# Altium project kashif.PrjPcb
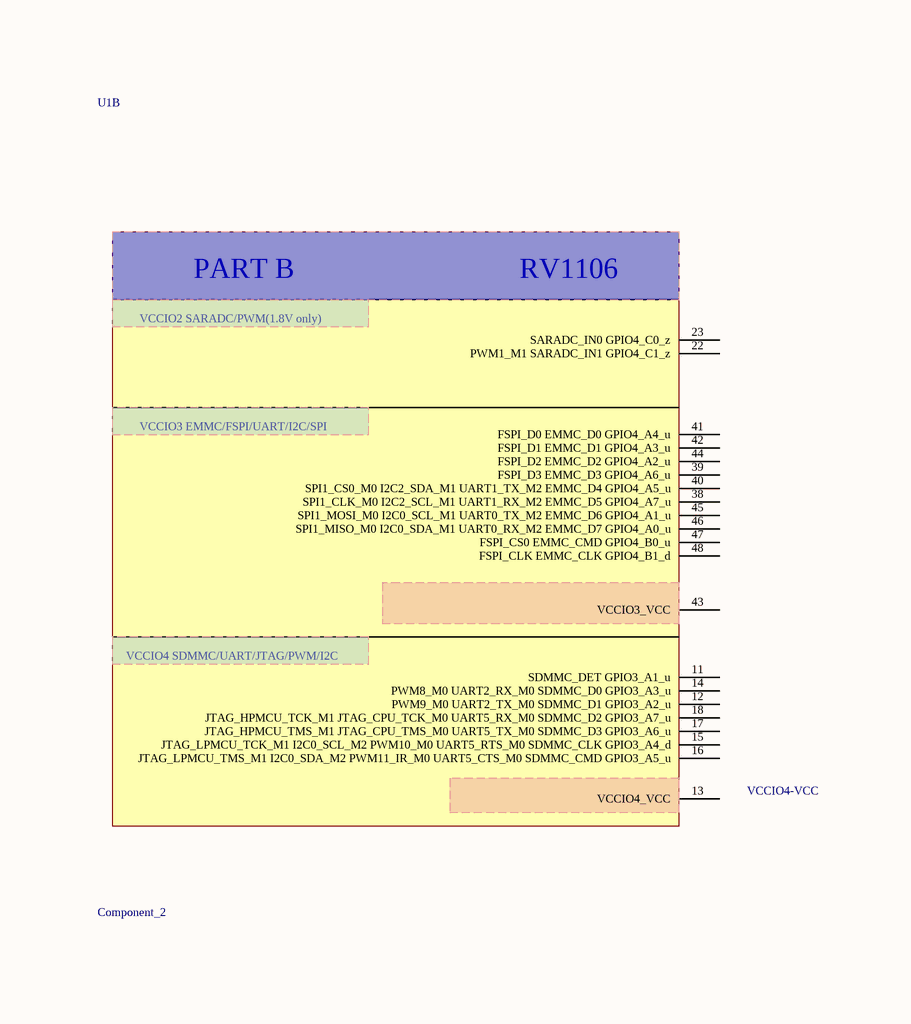
[diagram p0: main mcu.SchDoc, top left]
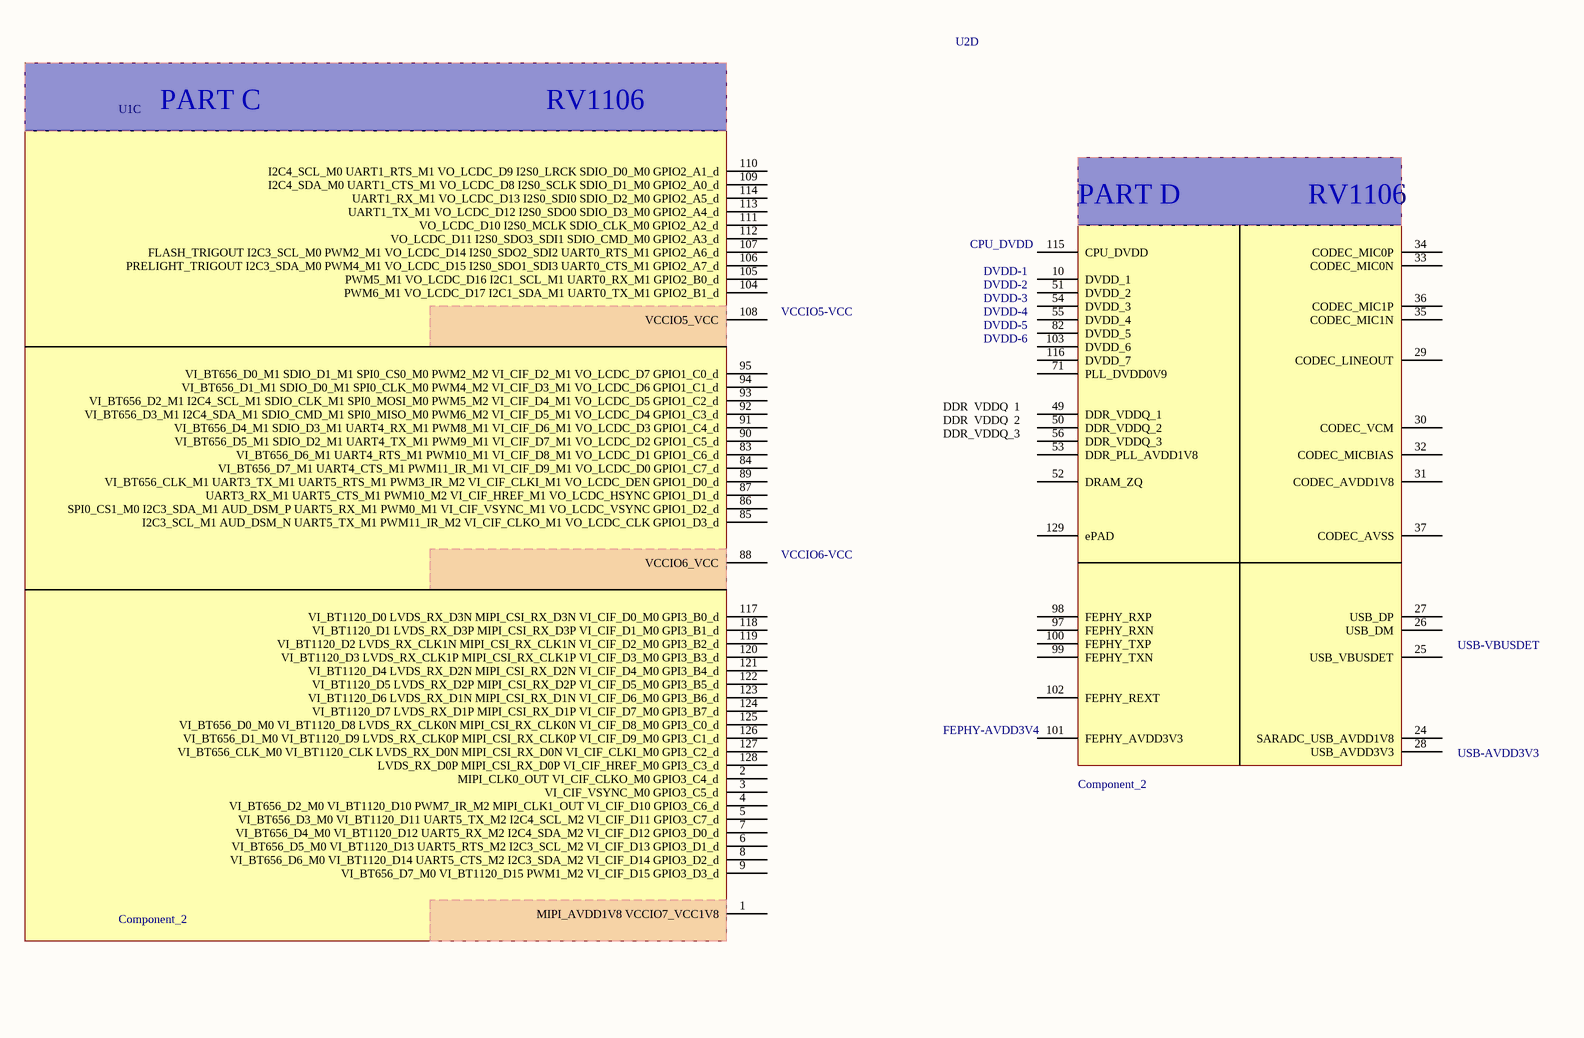
[diagram p1: main mcu.SchDoc, top right]
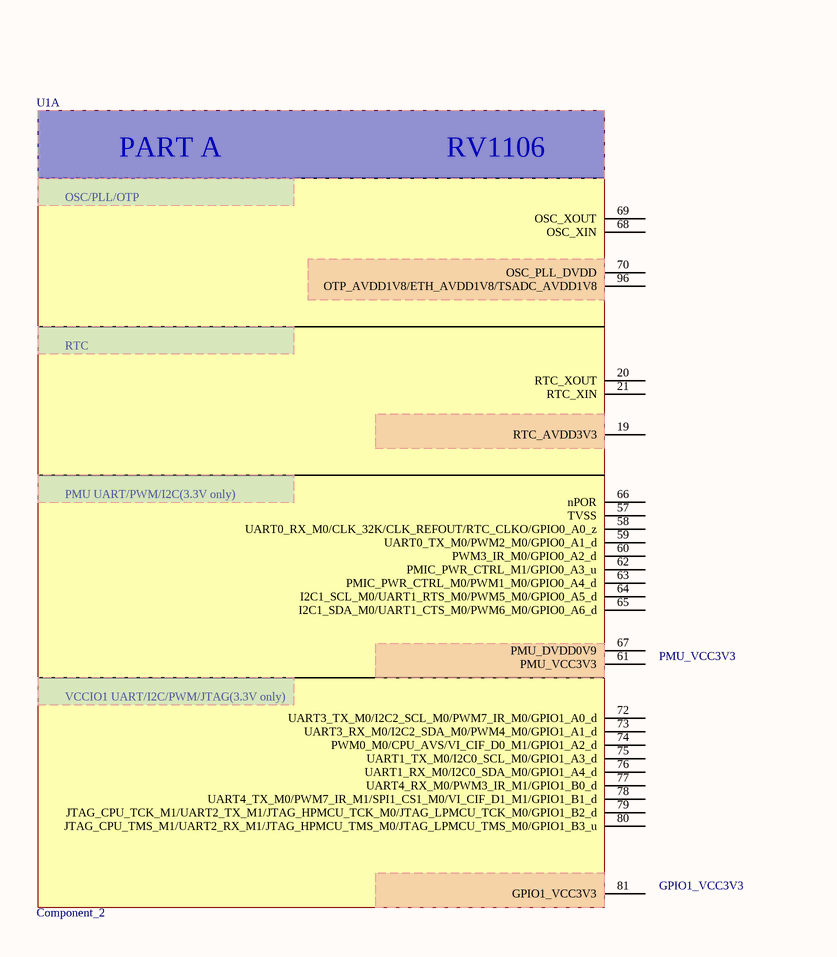
[diagram p2: main mcu.SchDoc, bottom left]
7 sheets, 131 parts. Net scope: global (net labels, ports and power ports of the same name join across sheets).
Board file: PCB1.PcbDoc
Sheets:
  main mcu.SchDoc
  CSI.SchDoc
  THERMAL.SchDoc
  ETHER.SchDoc
  power.SchDoc
  RXTRA.SchDoc
  32P MCU.SchDoc

## Sheet main mcu.SchDoc
size A1; SheetNumber: 1; SheetTotal: 5

### Parts
U1  Component_2  [QFN35P1230X1230X90_HS-129N]  (parts A,B,C of 4)
U2  Component_2  [QFN35P1230X1230X90_HS-129N]  (part D of 4)

### Nets

Not connected (* = marked no-connect by the designer): U1 1(MIPI_AVDD1V8_VCCIO7_VCC1V8) 2(MIPI_CLK0_OUT_VI_CIF_CLKO_M0_GPIO3_C4_d) 3(VI_CIF_VSYNC_M0_GPIO3_C5_d) 4(VI_BT656_D2_M0_VI_BT1120_D10_PWM7_IR_M2_MIPI_CLK1_OUT_VI_CIF_D10_GPIO3_C6_d) 5(VI_BT656_D3_M0_VI_BT1120_D11_UART5_TX_M2_I2C4_SCL_M2_VI_CIF_D11_GPIO3_C7_d) 6(VI_BT656_D5_M0_VI_BT1120_D13_UART5_RTS_M2_I2C3_SCL_M2_VI_CIF_D13_GPIO3_D1_d) 7(VI_BT656_D4_M0_VI_BT1120_D12_UART5_RX_M2_I2C4_SDA_M2_VI_CIF_D12_GPIO3_D0_d) 8(VI_BT656_D6_M0_VI_BT1120_D14_UART5_CTS_M2_I2C3_SDA_M2_VI_CIF_D14_GPIO3_D2_d) 9(VI_BT656_D7_M0_VI_BT1120_D15_PWM1_M2_VI_CIF_D15_GPIO3_D3_d) 11(SDMMC_DET_GPIO3_A1_u) 12(PWM9_M0_UART2_TX_M0_SDMMC_D1_GPIO3_A2_u) 13(VCCIO4_VCC) 14(PWM8_M0_UART2_RX_M0_SDMMC_D0_GPIO3_A3_u) 15(JTAG_LPMCU_TCK_M1_I2C0_SCL_M2_PWM10_M0_UART5_RTS_M0_SDMMC_CLK_GPIO3_A4_d) 16(JTAG_LPMCU_TMS_M1_I2C0_SDA_M2_PWM11_IR_M0_UART5_CTS_M0_SDMMC_CMD_GPIO3_A5_u) 17(JTAG_HPMCU_TMS_M1_JTAG_CPU_TMS_M0_UART5_TX_M0_SDMMC_D3_GPIO3_A6_u) 18(JTAG_HPMCU_TCK_M1_JTAG_CPU_TCK_M0_UART5_RX_M0_SDMMC_D2_GPIO3_A7_u) 19(RTC_AVDD3V3) 20(RTC_XOUT) 21(RTC_XIN) 22(PWM1_M1_SARADC_IN1_GPIO4_C1_z) 23(SARADC_IN0_GPIO4_C0_z) 38(SPI1_CLK_M0_I2C2_SCL_M1_UART1_RX_M2_EMMC_D5_GPIO4_A7_u) 39(FSPI_D3_EMMC_D3_GPIO4_A6_u) 40(SPI1_CS0_M0_I2C2_SDA_M1_UART1_TX_M2_EMMC_D4_GPIO4_A5_u) 41(FSPI_D0_EMMC_D0_GPIO4_A4_u) 42(FSPI_D1_EMMC_D1_GPIO4_A3_u) 43(VCCIO3_VCC) 44(FSPI_D2_EMMC_D2_GPIO4_A2_u) 45(SPI1_MOSI_M0_I2C0_SCL_M1_UART0_TX_M2_EMMC_D6_GPIO4_A1_u) 46(SPI1_MISO_M0_I2C0_SDA_M1_UART0_RX_M2_EMMC_D7_GPIO4_A0_u) 47(FSPI_CS0_EMMC_CMD_GPIO4_B0_u) 48(FSPI_CLK_EMMC_CLK_GPIO4_B1_d) 57(TVSS) 58(UART0_RX_M0/CLK_32K/CLK_REFOUT/RTC_CLKO/GPIO0_A0_z) 59(UART0_TX_M0/PWM2_M0/GPIO0_A1_d) 60(PWM3_IR_M0/GPIO0_A2_d) 61(PMU_VCC3V3) 62(PMIC_PWR_CTRL_M1/GPIO0_A3_u) 63(PMIC_PWR_CTRL_M0/PWM1_M0/GPIO0_A4_d) 64(I2C1_SCL_M0/UART1_RTS_M0/PWM5_M0/GPIO0_A5_d) 65(I2C1_SDA_M0/UART1_CTS_M0/PWM6_M0/GPIO0_A6_d) 66(nPOR) 67(PMU_DVDD0V9) 68(OSC_XIN) 69(OSC_XOUT) 70(OSC_PLL_DVDD) 72(UART3_TX_M0/I2C2_SCL_M0/PWM7_IR_M0/GPIO1_A0_d) 73(UART3_RX_M0/I2C2_SDA_M0/PWM4_M0/GPIO1_A1_d) 74(PWM0_M0/CPU_AVS/VI_CIF_D0_M1/GPIO1_A2_d) 75(UART1_TX_M0/I2C0_SCL_M0/GPIO1_A3_d) 76(UART1_RX_M0/I2C0_SDA_M0/GPIO1_A4_d) 77(UART4_RX_M0/PWM3_IR_M1/GPIO1_B0_d) 78(UART4_TX_M0/PWM7_IR_M1/SPI1_CS1_M0/VI_CIF_D1_M1/GPIO1_B1_d) 79(JTAG_CPU_TCK_M1/UART2_TX_M1/JTAG_HPMCU_TCK_M0/JTAG_LPMCU_TCK_M0/GPIO1_B2_d) 80(JTAG_CPU_TMS_M1/UART2_RX_M1/JTAG_HPMCU_TMS_M0/JTAG_LPMCU_TMS_M0/GPIO1_B3_u) 81(GPIO1_VCC3V3) 83(VI_BT656_D6_M1_UART4_RTS_M1_PWM10_M1_VI_CIF_D8_M1_VO_LCDC_D1_GPIO1_C6_d) 84(VI_BT656_D7_M1_UART4_CTS_M1_PWM11_IR_M1_VI_CIF_D9_M1_VO_LCDC_D0_GPIO1_C7_d) 85(I2C3_SCL_M1_AUD_DSM_N_UART5_TX_M1_PWM11_IR_M2_VI_CIF_CLKO_M1_VO_LCDC_CLK_GPIO1_D3_d) 86(SPI0_CS1_M0_I2C3_SDA_M1_AUD_DSM_P_UART5_RX_M1_PWM0_M1_VI_CIF_VSYNC_M1_VO_LCDC_VSYNC_GPIO1_D2_d) 87(UART3_RX_M1_UART5_CTS_M1_PWM10_M2_VI_CIF_HREF_M1_VO_LCDC_HSYNC_GPIO1_D1_d) 88(VCCIO6_VCC) 89(VI_BT656_CLK_M1_UART3_TX_M1_UART5_RTS_M1_PWM3_IR_M2_VI_CIF_CLKI_M1_VO_LCDC_DEN_GPIO1_D0_d) 90(VI_BT656_D5_M1_SDIO_D2_M1_UART4_TX_M1_PWM9_M1_VI_CIF_D7_M1_VO_LCDC_D2_GPIO1_C5_d) 91(VI_BT656_D4_M1_SDIO_D3_M1_UART4_RX_M1_PWM8_M1_VI_CIF_D6_M1_VO_LCDC_D3_GPIO1_C4_d) 92(VI_BT656_D3_M1_I2C4_SDA_M1_SDIO_CMD_M1_SPI0_MISO_M0_PWM6_M2_VI_CIF_D5_M1_VO_LCDC_D4_GPIO1_C3_d) 93(VI_BT656_D2_M1_I2C4_SCL_M1_SDIO_CLK_M1_SPI0_MOSI_M0_PWM5_M2_VI_CIF_D4_M1_VO_LCDC_D5_GPIO1_C2_d) 94(VI_BT656_D1_M1_SDIO_D0_M1_SPI0_CLK_M0_PWM4_M2_VI_CIF_D3_M1_VO_LCDC_D6_GPIO1_C1_d) 95(VI_BT656_D0_M1_SDIO_D1_M1_SPI0_CS0_M0_PWM2_M2_VI_CIF_D2_M1_VO_LCDC_D7_GPIO1_C0_d) 96(OTP_AVDD1V8/ETH_AVDD1V8/TSADC_AVDD1V8) 104(PWM6_M1_VO_LCDC_D17_I2C1_SDA_M1_UART0_TX_M1_GPIO2_B1_d) 105(PWM5_M1_VO_LCDC_D16_I2C1_SCL_M1_UART0_RX_M1_GPIO2_B0_d) 106(PRELIGHT_TRIGOUT_I2C3_SDA_M0_PWM4_M1_VO_LCDC_D15_I2S0_SDO1_SDI3_UART0_CTS_M1_GPIO2_A7_d) 107(FLASH_TRIGOUT_I2C3_SCL_M0_PWM2_M1_VO_LCDC_D14_I2S0_SDO2_SDI2_UART0_RTS_M1_GPIO2_A6_d) 108(VCCIO5_VCC) 109(I2C4_SDA_M0_UART1_CTS_M1_VO_LCDC_D8_I2S0_SCLK_SDIO_D1_M0_GPIO2_A0_d) 110(I2C4_SCL_M0_UART1_RTS_M1_VO_LCDC_D9_I2S0_LRCK_SDIO_D0_M0_GPIO2_A1_d) 111(VO_LCDC_D10_I2S0_MCLK_SDIO_CLK_M0_GPIO2_A2_d) 112(VO_LCDC_D11_I2S0_SDO3_SDI1_SDIO_CMD_M0_GPIO2_A3_d) 113(UART1_TX_M1_VO_LCDC_D12_I2S0_SDO0_SDIO_D3_M0_GPIO2_A4_d) 114(UART1_RX_M1_VO_LCDC_D13_I2S0_SDI0_SDIO_D2_M0_GPIO2_A5_d) 117(VI_BT1120_D0_LVDS_RX_D3N_MIPI_CSI_RX_D3N_VI_CIF_D0_M0_GPI3_B0_d) 118(VI_BT1120_D1_LVDS_RX_D3P_MIPI_CSI_RX_D3P_VI_CIF_D1_M0_GPI3_B1_d) 119(VI_BT1120_D2_LVDS_RX_CLK1N_MIPI_CSI_RX_CLK1N_VI_CIF_D2_M0_GPI3_B2_d) 120(VI_BT1120_D3_LVDS_RX_CLK1P_MIPI_CSI_RX_CLK1P_VI_CIF_D3_M0_GPI3_B3_d) 121(VI_BT1120_D4_LVDS_RX_D2N_MIPI_CSI_RX_D2N_VI_CIF_D4_M0_GPI3_B4_d) 122(VI_BT1120_D5_LVDS_RX_D2P_MIPI_CSI_RX_D2P_VI_CIF_D5_M0_GPI3_B5_d) 123(VI_BT1120_D6_LVDS_RX_D1N_MIPI_CSI_RX_D1N_VI_CIF_D6_M0_GPI3_B6_d) 124(VI_BT1120_D7_LVDS_RX_D1P_MIPI_CSI_RX_D1P_VI_CIF_D7_M0_GPI3_B7_d) 125(VI_BT656_D0_M0_VI_BT1120_D8_LVDS_RX_CLK0N_MIPI_CSI_RX_CLK0N_VI_CIF_D8_M0_GPI3_C0_d) 126(VI_BT656_D1_M0_VI_BT1120_D9_LVDS_RX_CLK0P_MIPI_CSI_RX_CLK0P_VI_CIF_D9_M0_GPI3_C1_d) 127(VI_BT656_CLK_M0_VI_BT1120_CLK_LVDS_RX_D0N_MIPI_CSI_RX_D0N_VI_CIF_CLKI_M0_GPI3_C2_d) 128(LVDS_RX_D0P_MIPI_CSI_RX_D0P_VI_CIF_HREF_M0_GPI3_C3_d); U2 10(DVDD_1) 24(SARADC_USB_AVDD1V8) 25(USB_VBUSDET) 26(USB_DM) 27(USB_DP) 28(USB_AVDD3V3) 29(CODEC_LINEOUT) 30(CODEC_VCM) 31(CODEC_AVDD1V8) 32(CODEC_MICBIAS) 33(CODEC_MIC0N) 34(CODEC_MIC0P) 35(CODEC_MIC1N) 36(CODEC_MIC1P) 37(CODEC_AVSS) 49(DDR_VDDQ_1) 50(DDR_VDDQ_2) 51(DVDD_2) 52(DRAM_ZQ) 53(DDR_PLL_AVDD1V8) 54(DVDD_3) 55(DVDD_4) 56(DDR_VDDQ_3) 71(PLL_DVDD0V9) 82(DVDD_5) 97(FEPHY_RXN) 98(FEPHY_RXP) 99(FEPHY_TXN) 100(FEPHY_TXP) 101(FEPHY_AVDD3V3) 102(FEPHY_REXT) 103(DVDD_6) 115(CPU_DVDD) 116(DVDD_7) 129(ePAD)

### Notes on the sheet
- CPU_DVDD
- VCCIO5-VCC
- DVDD-1
- DVDD-5
- DVDD-2
- DVDD-3
- DVDD-4
- DVDD-6
- (near U2) DDR_VDDQ_1
- (near U2) DDR_VDDQ_2
- (near U2) DDR_VDDQ_3
- VCCIO6-VCC
- USB-VBUSDET
- FEPHY-AVDD3V4
- USB-AVDD3V3
- VCCIO4-VCC
- PMU_VCC3V3
- GPIO1_VCC3V3
- (in symbol Component_2, part A) PART A                              RV1106; OSC/PLL/OTP; RTC; PMU UART/PWM/I2C(3.3V only); VCCIO1 UART/I2C/PWM/JTAG(3.3V only)
- (in symbol Component_2, part B) PART B                              RV1106; VCCIO2 SARADC/PWM(1.8V only); VCCIO3 EMMC/FSPI/UART/I2C/SPI; VCCIO4 SDMMC/UART/JTAG/PWM/I2C
- (in symbol Component_2, part C) PART C                                      RV1106
- (in symbol Component_2, part D) PART D                 RV1106

## Sheet CSI.SchDoc
size A; SheetNumber: 2; SheetTotal: 7
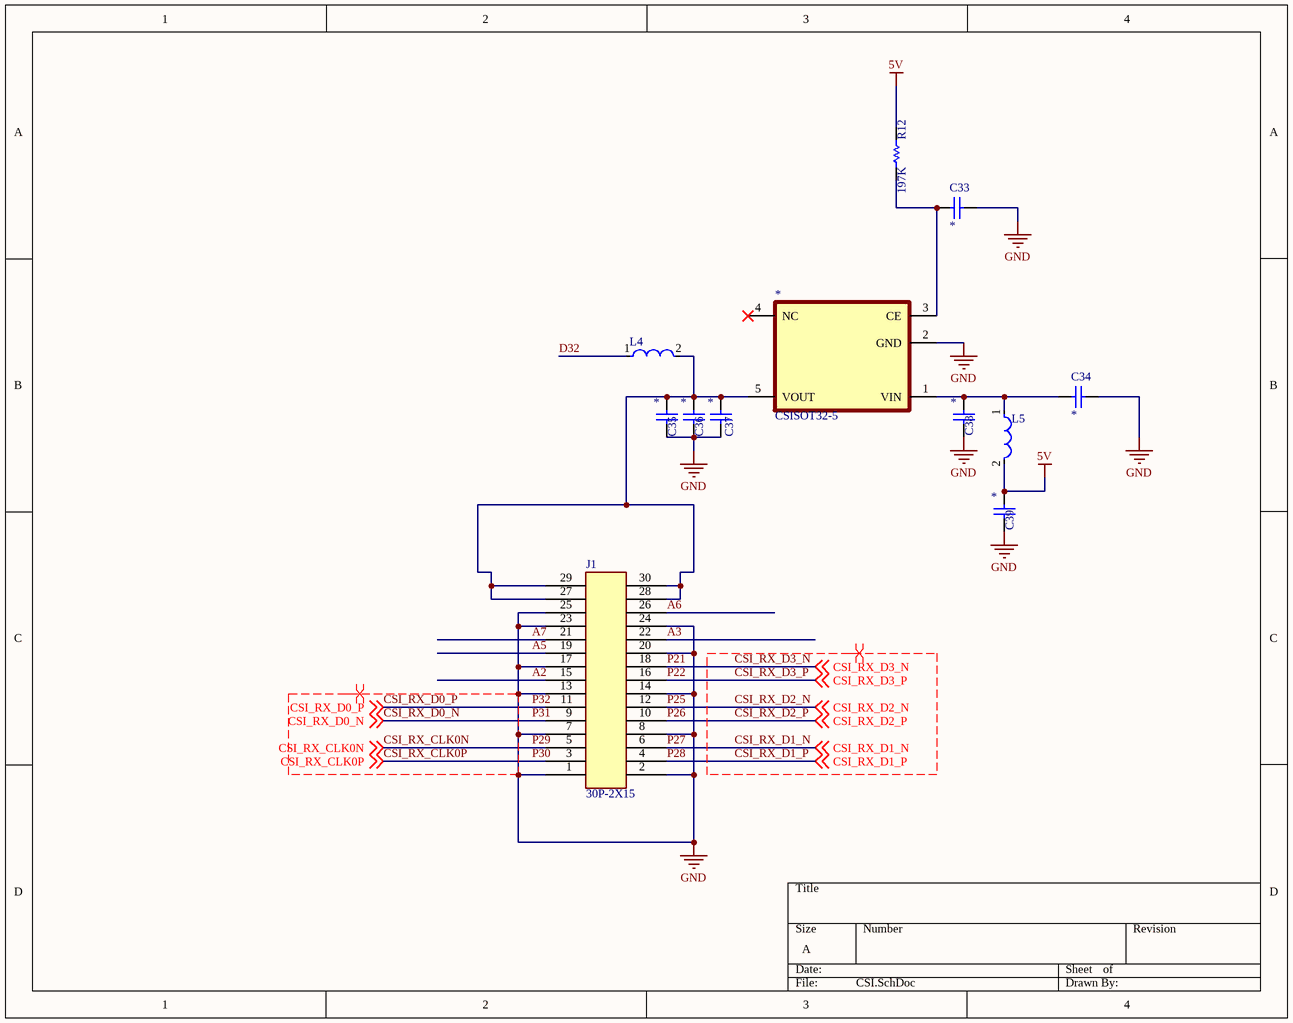
[diagram p3: CSI.SchDoc]

### Parts
(Parts that share a designator on the sheet are numbered #1, #2 ... from top to bottom, then left to right.)
*#1  CSISOT32-5
C33  *  [CAPC1005X56X25LL10T15]
C34  *  [CAPC1005X56X25LL10T15]
C35  *  [CAPC1005X56X25LL10T15]
C36  *  [CAPC1005X56X25LL10T15]
C37  *  [CAPC1005X56X25LL10T15]
C38  *  [CAPC1005X56X25LL10T15]
C39  *  [CAPC1005X56X25LL10T15]
J1  30P-2X15
L4  (no value)  [FP-LQH31CN_03-MFG]
L5  (no value)  [FP-LQH31CN_03-MFG]
R12  197K  [RESC1005X40X25LL05T10]

### Nets
5V: C39.2 L5.2 R12.2
GND: *#1.2(GND) C33.2 C34.2 C35.1 C36.1 C37.1 C38.1 C39.1 J1.1 J1.2 J1.7 J1.8 J1.13 J1.14 J1.17 J1.20 J1.23 J1.24 J1.25
A2: J1.15
A3: J1.22
A5: J1.19
A6: J1.26
A7: J1.21
CSI_RX_CLK0N: J1.5 ; off-sheet CSI_RX_CLK0N  [also labelled P29]
CSI_RX_CLK0P: J1.3 ; off-sheet CSI_RX_CLK0P  [also labelled P30]
CSI_RX_D0_N: J1.9 ; off-sheet CSI_RX_D0_N  [also labelled P31]
CSI_RX_D0_P: J1.11 ; off-sheet CSI_RX_D0_P  [also labelled P32]
CSI_RX_D1_N: J1.6 ; off-sheet CSI_RX_D1_N  [also labelled P27]
CSI_RX_D1_P: J1.4 ; off-sheet CSI_RX_D1_P  [also labelled P28]
CSI_RX_D2_N: J1.12 ; off-sheet CSI_RX_D2_N  [also labelled P25]
CSI_RX_D2_P: J1.10 ; off-sheet CSI_RX_D2_P  [also labelled P26]
CSI_RX_D3_N: J1.18 ; off-sheet CSI_RX_D3_N  [also labelled P21]
CSI_RX_D3_P: J1.16 ; off-sheet CSI_RX_D3_P  [also labelled P22]
D32: L4.1
Net*#1_1: *#1.1(VIN) C34.1 C38.2 L5.1
Net*#1_3: *#1.3(CE) C33.1 R12.1
Net*#1_5: *#1.5(VOUT) C35.2 C36.2 C37.2 J1.27 J1.28 J1.29 J1.30 L4.2

Not connected (* = marked no-connect by the designer): *#1 4(NC)*

### Layout directives
differential pair; differential pair class CSI; net class CSI_DIFF: CSI_RX_CLK0N, CSI_RX_CLK0P, CSI_RX_D0_N, CSI_RX_D0_P, CSI_RX_D1_N, CSI_RX_D1_P, CSI_RX_D2_N, CSI_RX_D2_P, CSI_RX_D3_N, CSI_RX_D3_P

### Library data of the parts
C33-C39 = CMP-2008-02962-1: VALUE: *
L4 L5 = CMP-06042-002477-1
R12 = CMP-2002-07161-1: VALUE: 197K

## Sheet THERMAL.SchDoc
size A; SheetNumber: 3; SheetTotal: 5
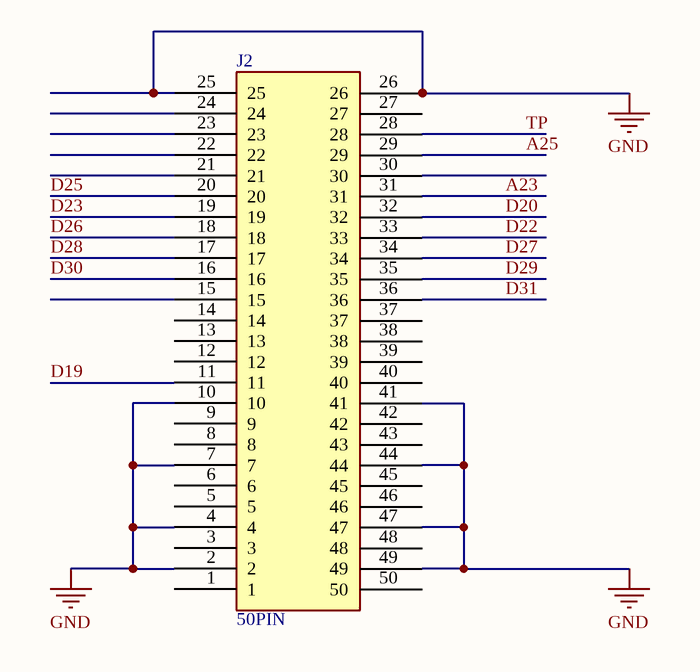
[diagram p4: THERMAL.SchDoc]

### Parts
J2  50PIN

### Nets
GND: J2.2 J2.4 J2.7 J2.10 J2.25 J2.26 J2.41 J2.44 J2.47 J2.49
A23: J2.31
A25: J2.29
D19: J2.11
D20: J2.32
D22: J2.33
D23: J2.19
D25: J2.20
D26: J2.16 J2.18  [also labelled D30]  [project net A10]
D27: J2.34
D28: J2.17
D29: J2.35
D31: J2.36
TP: J2.28  [project net C9]

Not connected (* = marked no-connect by the designer): J2 1 3 5 6 8 9 12 13 14 15 21 22 23 24 27 30 37 38 39 40 42 43 45 46 48 50

## Sheet ETHER.SchDoc
size A; SheetNumber: 4; SheetTotal: 7
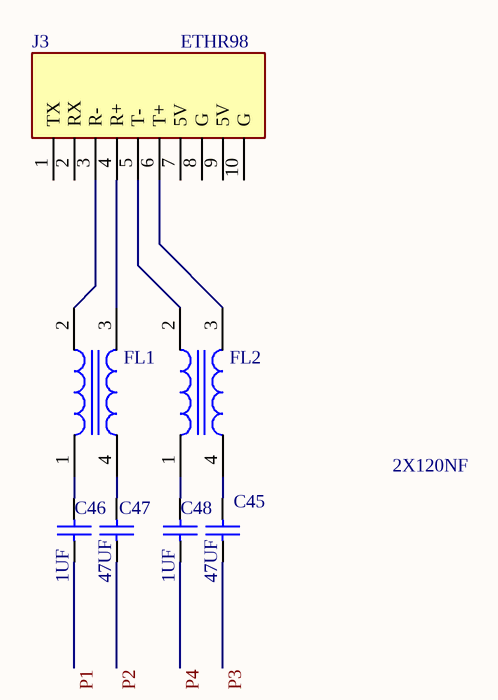
[diagram p5: ETHER.SchDoc]

### Parts
C45  47UF  [CAPC1005X56X25LL10T15]
C46  1UF  [CAPC1005X56X25LL10T15]
C47  47UF  [CAPC1005X56X25LL10T15]
C48  1UF  [CAPC1005X56X25LL10T15]
FL1  B82789C0513N002  [FL_B82789C0513N002]  (value not drawn)
FL2  B82789C0513N002  [FL_B82789C0513N002]  (value not drawn)
J3  ETHR98

### Nets
P1: C46.1
P2: C47.1
P3: C45.1
P4: C48.1
NetC45_2: C45.2 FL2.4
NetC46_2: C46.2 FL1.1
NetC47_2: C47.2 FL1.4
NetC48_2: C48.2 FL2.1
NetFL1_2: FL1.2 J3.3(R-)
NetFL1_3: FL1.3 J3.4(R+)
NetFL2_2: FL2.2 J3.5(T-)
NetFL2_3: FL2.3 J3.6(T+)

Not connected (* = marked no-connect by the designer): J3 1(TX) 2(RX) 7(5V) 8(G) 9(5V) 10(G)

### Notes on the sheet
- 2X120NF

### Library data of the parts
C45-C48 = CMP-2008-02962-1
  C45 C47: VALUE: 47UF
  C46 C48: VALUE: 1UF
FL1 FL2 = B82789C0513N002: 51 ÂµH @ 100 kHz 2 Line Common Mode Choke Surface Mount 250mA DCR 550mOhm; MF: EPCOS; SnapEDA_Link: https://www.snapeda.com/parts/B82789C0513N002/EPCOS/view-part/?ref=snap; Package: NON STANDARD-4 TDK; Value: *; MP: B82789C0513N002; Check_prices: https://www.snapeda.com/parts/B82789C0513N002/EPCOS/view-part/?ref=eda

## Sheet power.SchDoc
size A2; SheetNumber: 5; SheetTotal: 6
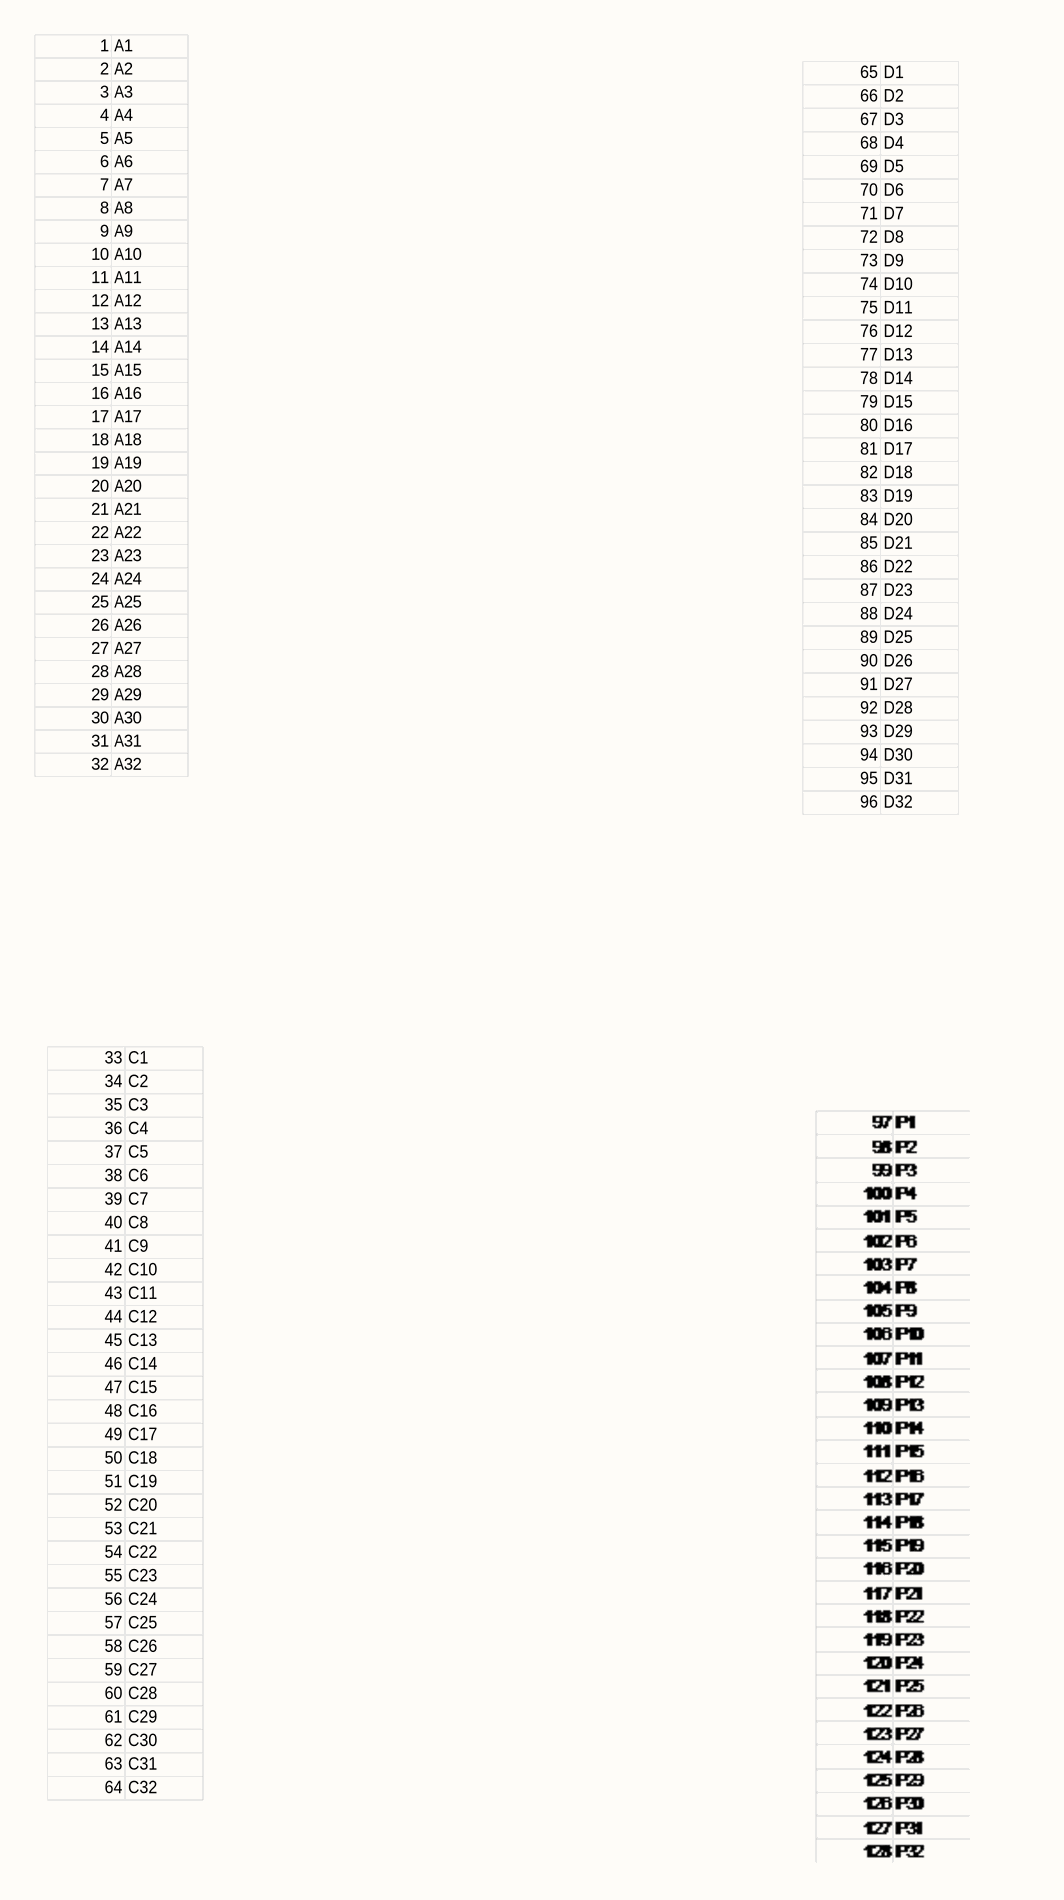
[diagram p6: power.SchDoc, left]
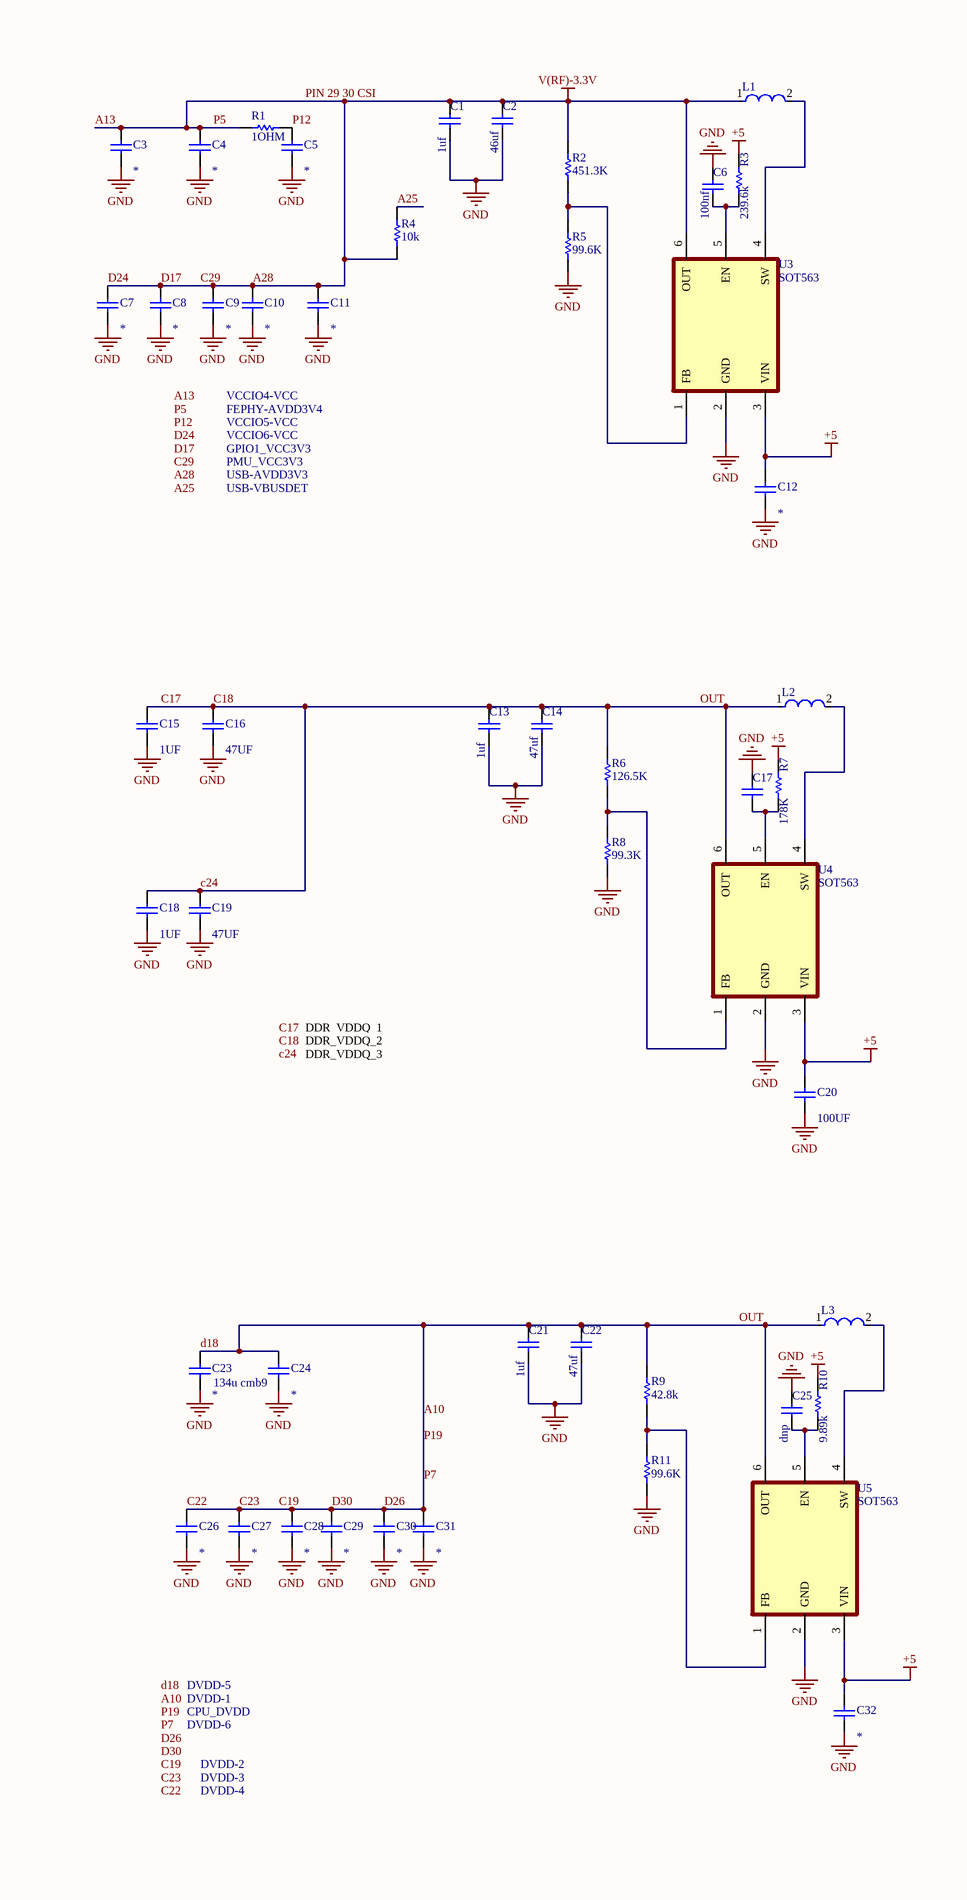
[diagram p7: power.SchDoc, right]

### Parts
C1  1uf  [CAPC1005X56X25LL10T15]
C2  46uf  [CAPC1005X56X25LL10T15]
C3  *  [CAPC1005X56X25LL10T15]
C4  *  [CAPC1005X56X25LL10T15]
C5  *  [CAPC1005X56X25LL10T15]
C6  100nf  [CAPC1005X56X25LL10T15]
C7  *  [CAPC1005X56X25LL10T15]
C8  *  [CAPC1005X56X25LL10T15]
C9  *  [CAPC1005X56X25LL10T15]
C10  *  [CAPC1005X56X25LL10T15]
C11  *  [CAPC1005X56X25LL10T15]
C12  *  [CAPC1005X56X25LL10T15]
C13  1uf  [CAPC1005X56X25LL10T15]
C14  47uf  [CAPC1005X56X25LL10T15]
C15  1UF  [CAPC1005X56X25LL10T15]
C16  47UF  [CAPC1005X56X25LL10T15]
C17  (no value)  [CAPC1005X56X25LL10T15]
C18  1UF  [CAPC1005X56X25LL10T15]
C19  47UF  [CAPC1005X56X25LL10T15]
C20  100UF  [CAPC1005X56X25LL10T15]
C21  1uf  [CAPC1005X56X25LL10T15]
C22  47uf  [CAPC1005X56X25LL10T15]
C23  *  [CAPC1005X56X25LL10T15]
C24  *  [CAPC1005X56X25LL10T15]
C25  dnp  [CAPC1005X56X25LL10T15]
C26  *  [CAPC1005X56X25LL10T15]
C27  *  [CAPC1005X56X25LL10T15]
C28  *  [CAPC1005X56X25LL10T15]
C29  *  [CAPC1005X56X25LL10T15]
C30  *  [CAPC1005X56X25LL10T15]
C31  *  [CAPC1005X56X25LL10T15]
C32  *  [CAPC1005X56X25LL10T15]
L1  (no value)  [FP-LQH31CN_03-MFG]
L2  (no value)  [FP-LQH31CN_03-MFG]
L3  (no value)  [FP-LQH31CN_03-MFG]
R1  1OHM  [RESC1005X40X25LL05T10]
R2  451.3K  [RESC1005X40X25LL05T10]
R3  239.6k  [RESC1005X40X25LL05T10]
R4  10k  [RESC1005X40X25LL05T10]
R5  99.6K  [RESC1005X40X25LL05T10]
R6  126.5K  [RESC1005X40X25LL05T10]
R7  178K  [RESC1005X40X25LL05T10]
R8  99.3K  [RESC1005X40X25LL05T10]
R9  42.8k  [RESC1005X40X25LL05T10]
R10  9.89k  [RESC1005X40X25LL05T10]
R11  99.6K  [RESC1005X40X25LL05T10]
U3  SOT563
U4  SOT563
U5  SOT563

### Nets
+5: C12.2 C20.2 C32.2 R3.2 R7.2 R10.2 U3.3(VIN) U4.3(VIN) U5.3(VIN)
A13: C1.2 C2.2 C3.2 C4.2 C7.2 C8.2 C9.2 C10.2 C11.2 L1.1 R1.2 R2.2 R4.1 U3.6(OUT)  [also labelled A28, C29, D17, D24, P5, PIN 29 30 CSI, V(RF)-3.3V]
GND: C1.1 C2.1 C3.1 C4.1 C5.1 C6.2 C7.1 C8.1 C9.1 C10.1 C11.1 C12.1 C13.1 C14.1 C15.1 C16.1 C17.2 C18.1 C19.1 C20.1 C21.1 C22.1 C23.1 C24.1 C25.2 C26.1 C27.1 C28.1 C29.1 C30.1 C31.1 C32.1 R5.1 R8.1 R11.1 U3.2(GND) U4.2(GND) U5.2(GND)
A10: C13.2 C14.2 C15.2 C16.2 C18.2 C19.2 C21.2 C22.2 C23.2 C24.2 C26.2 C27.2 C28.2 C29.2 C30.2 C31.2 L2.1 L3.1 R6.2 R9.2 U4.6(OUT) U5.6(OUT)  [also labelled C17, C18, C19, C22, C23, c24, d18, D26, D30, OUT, P19, P7]
A25: R4.2
P12: C5.2 R1.1
NetC6_1: C6.1 R3.1 U3.5(EN)
NetC17_1: C17.1 R7.1 U4.5(EN)
NetC25_1: C25.1 R10.1 U5.5(EN)
NetL1_2: L1.2 U3.4(SW)
NetL2_2: L2.2 U4.4(SW)
NetL3_2: L3.2 U5.4(SW)
NetR2_1: R2.1 R5.2 U3.1(FB)
NetR6_1: R6.1 R8.2 U4.1(FB)
NetR9_1: R9.1 R11.2 U5.1(FB)

### Notes on the sheet
- VCCIO4-VCC
- FEPHY-AVDD3V4
- USB-AVDD3V3
- VCCIO5-VCC
- VCCIO6-VCC
- GPIO1_VCC3V3
- PMU_VCC3V3
- USB-VBUSDET
- DDR_VDDQ_1
- DDR_VDDQ_2
- DDR_VDDQ_3
- 134u cmb9
- DVDD-1
- DVDD-5
- CPU_DVDD
- DVDD-6
- DVDD-2
- DVDD-3
- DVDD-4
- Labels drawn without touching a wire or pin: A10, A13, A25, A28, C17, C18, C19, C22, C23, c24, C29, D17, d18, D24, D26, D30, P5, P7, P12, P19

### Library data of the parts
C1-C32 = CMP-2008-02962-1
  C1 C13 C21: VALUE: 1uf
  C2: VALUE: 46uf
  C3-C5 C7-C12 C23 C24 C26-C32: VALUE: *
  C6: VALUE: 100nf
  C14 C22: VALUE: 47uf
  C15 C18: VALUE: 1UF
  C16 C19: VALUE: 47UF
  C20: VALUE: 100UF
  C25: VALUE: dnp
L1-L3 = CMP-06042-002477-1
R1-R11 = CMP-2002-07161-1
  R1: VALUE: 1OHM
  R2: VALUE: 451.3K
  R3: VALUE: 239.6k
  R4: VALUE: 10k
  R5 R11: VALUE: 99.6K
  R6: VALUE: 126.5K
  R7: VALUE: 178K
  R8: VALUE: 99.3K
  R9: VALUE: 42.8k
  R10: VALUE: 9.89k

## Sheet RXTRA.SchDoc
size A; SheetNumber: 6; SheetTotal: 6
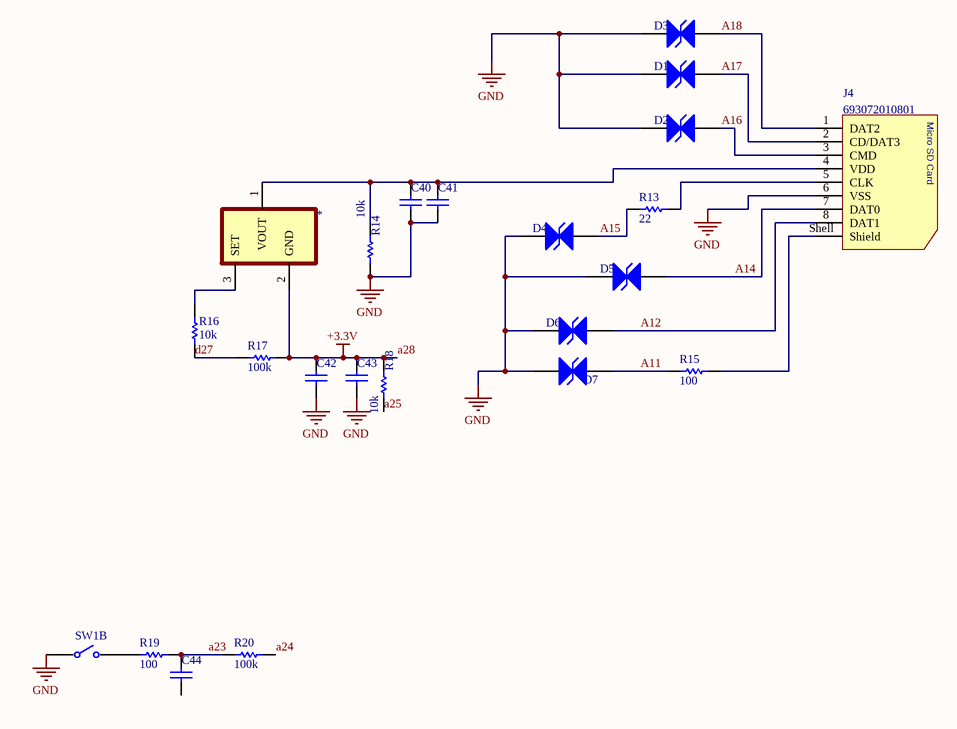
[diagram p8: RXTRA.SchDoc]

### Parts
(Parts that share a designator on the sheet are numbered #1, #2 ... from top to bottom, then left to right.)
*#2  Component_1  (value not drawn)
C40  (no value)  [CAPC1005X56X25LL10T15]
C41  (no value)  [CAPC1005X56X25LL10T15]
C42  (no value)  [CAPC1005X56X25LL10T15]
C43  (no value)  [CAPC1005X56X25LL10T15]
C44  (no value)  [CAPC1005X56X25LL10T15]
D1  824541700  [WE-TVSP_DO-214AB_Bidirectional]  (value not drawn)
D2  824541700  [WE-TVSP_DO-214AB_Bidirectional]  (value not drawn)
D3  824541700  [WE-TVSP_DO-214AB_Bidirectional]  (value not drawn)
D4  824541700  [WE-TVSP_DO-214AB_Bidirectional]  (value not drawn)
D5  824541700  [WE-TVSP_DO-214AB_Bidirectional]  (value not drawn)
D6  824541700  [WE-TVSP_DO-214AB_Bidirectional]  (value not drawn)
D7  824541700  [WE-TVSP_DO-214AB_Bidirectional]  (value not drawn)
J4  693072010801  [693072010801]
R13  22  [RESC1005X40X25LL05T10]
R14  10k  [RESC1005X40X25LL05T10]
R15  100  [RESC1005X40X25LL05T10]
R16  10k  [RESC1005X40X25LL05T10]
R17  100k  [RESC1005X40X25LL05T10]
R18  10k  [RESC1005X40X25LL05T10]
R19  100  [RESC1005X40X25LL05T10]
R20  100k  [RESC1005X40X25LL05T10]
SW1  1825057-1  [FP-1825057-1-MFG]  (value not drawn)  (part B of 2)

### Nets
+3.3V: *#2.2(GND) C42.2 C43.2 R17.1 R18.2  [also labelled a28]  [project net A13]
GND: C40.1 C41.1 C42.1 C43.1 D1.1 D2.1 D3.1 D4.1 D5.1 D6.1 D7.2 J4.6(VSS) R14.1 SW1.2
A11: D7.1 R15.2
A12: D6.2 J4.8(DAT1)
A14: D5.2 J4.7(DAT0)
A15: D4.2 R13.2
A16: D2.2 J4.3(CMD)
A17: D1.2 J4.2(CD/DAT3)
A18: D3.2 J4.1(DAT2)
A23: C44.2 R19.1 R20.2
a24: R20.1
A25: R18.1
D27: R16.1 R17.2
Net*#2_1: *#2.1(VOUT) C40.2 C41.2 J4.4(VDD) R14.2
Net*#2_3: *#2.3(SET) R16.2
NetJ4_5: J4.5(CLK) R13.1
NetJ4_Shell: J4.Shell(Shield) R15.1
NetR19_2: R19.2 SW1.3

Not connected (* = marked no-connect by the designer): C44 1

### Notes on the sheet
- (in symbol CMP-1502-00164-3) Micro SD Card

### Library data of the parts
C40-C44 = CMP-2008-02962-1
D1-D7 = CMP-03913-71101710-2: TVS diode [Würth Elektronik] 824541700 TVS diode; Leakage Current: 400µA; Polarity: Bidirectional; Min Breakdown Voltage: 8.19V; Peak Pulse Power: 1.5kW; Clamping Voltage: 12V; Peak Pulse Current: 125A; Number of Bidirectional Channels: 1; Reverse Standoff Voltage: 7V; Power Line Protection: No; Composition: Zener; REACH SVHC: Unknown; Packaging: Cut Tape; Mount: Surface Mount; Length: 6.86mm; RoHS: Compliant; Width: 5.91mm; Number of Pins: 2; Max Operating Temperature: 150°C; Max Breakdown Voltage: 8.19V; Min Operating Temperature: -65°C; Height: 2.5mm
J4 = CMP-1502-00164-3: Conn, Memory Skt, Microsd, 8POS, Hinged Rohs Compliant: Yes; Insulation Resistance: 1GΩ; Connector Type: Connector; Memory Type: FLASH; Number of Contacts: 8; Voltage Rating: 100V; Current Rating: 500mA; Contact Material: Gold; Min Operating Temperature: -25°C; Number of Pins: 8; Contact Plating: Gold; REACH SVHC: Unknown; RoHS: Compliant; Color: Black; Number of Positions: 8; Mount: Surface Mount; Length: 14.5mm; Height: 1.95mm; Packaging: Tape and Reel; Max Operating Temperature: 85°C; Width: 13.5mm; Operating Supply Voltage: 100V
R13-R20 = CMP-2002-07161-1
  R13: VALUE: 22
  R14 R16 R18: VALUE: 10k
  R15 R19: VALUE: 100
  R17 R20: VALUE: 100k
SW1 = CMP-03400-000012-1: SWITCH SLIDE DIP SPST 100MA 24V; Manufacturer: TE Connectivity; Contact Resistance: 50mΩ; Electromechanical Life: 1000Cycles; Standoff Height: 1.3mm; Number Of Circuits: 2; Description: Switch DIP OFF ON SPST 2 Raised Slide 0.1A 24VDC PC Pins 2.54mm Thru-Hole Tube; Contact Current Rating: 100mA; ComponentLink2URL: https://www.te.com/commerce/DocumentDelivery/DDEController?Action=srchrtrv&DocNm=1825057&DocType=Customer+Drawing&DocLang=English; Digikey Description: SWITCH SLIDE DIP SPST 100MA 24V; Temperature: -30°C to +85°C; Lead Free: Yes; ComponentLink2Description: Datasheet; Octopart: https://octopart.com/1825057-1-te+connectivity-46507313; Manufacturer Part Number: 1825057-1; Automotive: No; Voltage Rating Dc: 24V; RoHS: TRUE; Package: 1825057-1; Device Class L1: Electromechanical; Temperature Range Low: -30°C; Device Class L2: Switches; Mount: Through Hole; Device Class L3: DIP Switches; Height: 6.15mm; Category: Switch; Temperature Range High: +85°C; Throw Configuration: SPST

## Sheet 32P MCU.SchDoc
size A; SheetNumber: 7; SheetTotal: 7
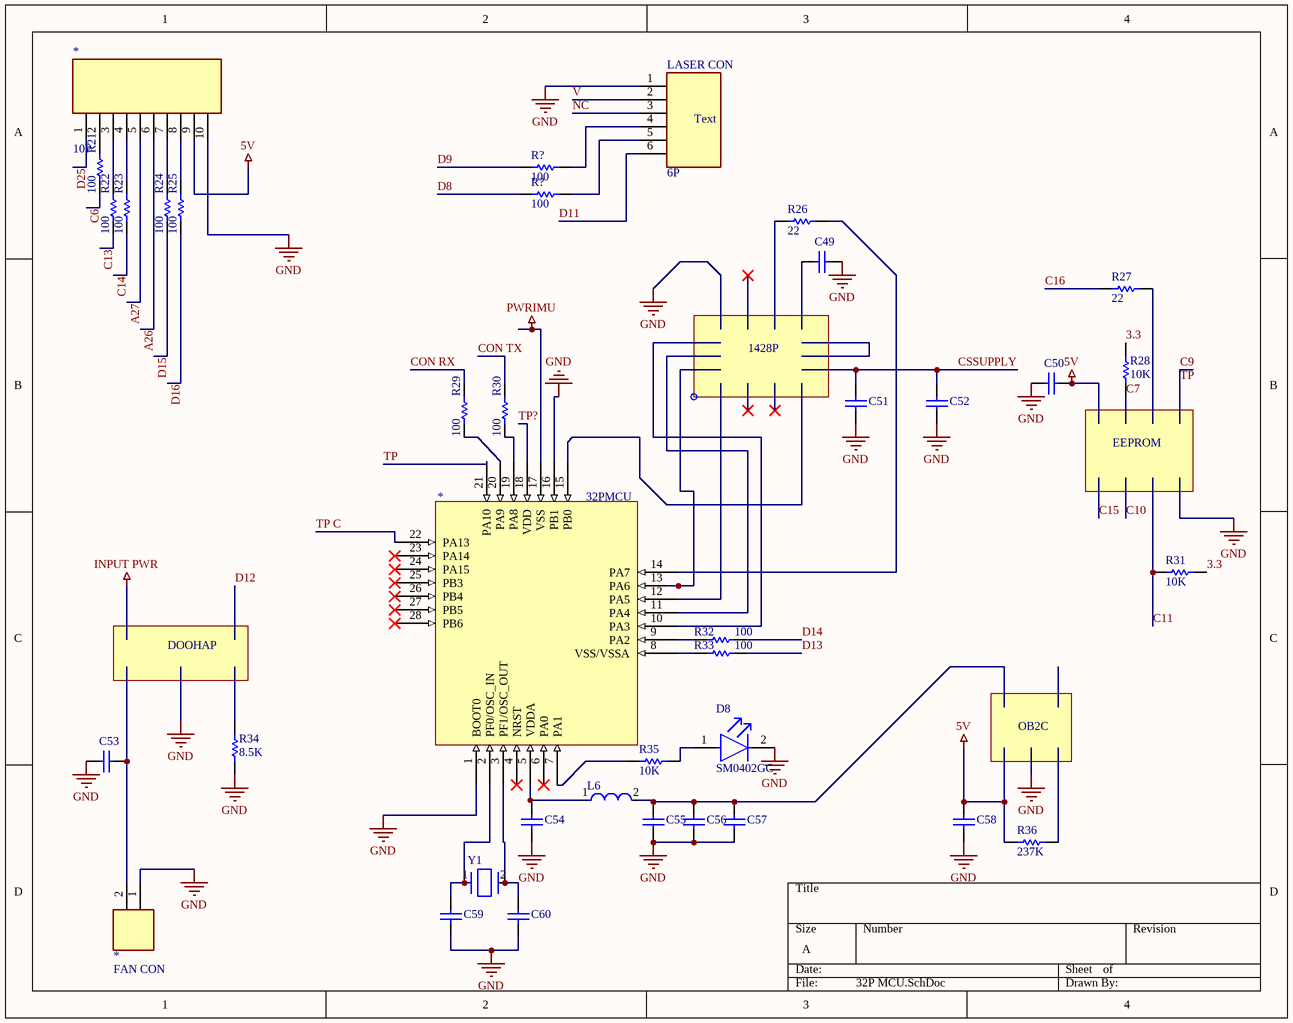
[diagram p9: 32P MCU.SchDoc]

### Parts
(Parts that share a designator on the sheet are numbered #1, #2 ... from top to bottom, then left to right.)
*#3  10P
*#4  32PMCU
*#5  FAN CON
C49  (no value)  [CAPC1005X56X25LL10T15]
C50  (no value)  [CAPC1005X56X25LL10T15]
C51  (no value)  [CAPC1005X56X25LL10T15]
C52  (no value)  [CAPC1005X56X25LL10T15]
C53  (no value)  [CAPC1005X56X25LL10T15]
C54  (no value)  [CAPC1005X56X25LL10T15]
C55  (no value)  [CAPC1005X56X25LL10T15]
C56  (no value)  [CAPC1005X56X25LL10T15]
C57  (no value)  [CAPC1005X56X25LL10T15]
C58  (no value)  [CAPC1005X56X25LL10T15]
C59  (no value)  [CAPC1005X56X25LL10T15]
C60  (no value)  [CAPC1005X56X25LL10T15]
D8  SM0402GC  [FP-SM0402GC-MFG]
L6  (no value)  [FP-LQH31CN_03-MFG]
LASER_CON  6P
R21  100  [RESC1005X40X25LL05T10]
R22  100  [RESC1005X40X25LL05T10]
R23  100  [RESC1005X40X25LL05T10]
R24  100  [RESC1005X40X25LL05T10]
R25  100  [RESC1005X40X25LL05T10]
R26  22  [RESC1005X40X25LL05T10]
R27  22  [RESC1005X40X25LL05T10]
R28  10K  [RESC1005X40X25LL05T10]
R29  100  [RESC1005X40X25LL05T10]
R30  100  [RESC1005X40X25LL05T10]
R31  10K  [RESC1005X40X25LL05T10]
R32  100  [RESC1005X40X25LL05T10]
R33  100  [RESC1005X40X25LL05T10]
R34  8.5K  [RESC1005X40X25LL05T10]
R35  10K  [RESC1005X40X25LL05T10]
R36  237K  [RESC1005X40X25LL05T10]
R?#1  100  [RESC1005X40X25LL05T10]
R?#2  100  [RESC1005X40X25LL05T10]
Y1  (no value)  [FP-TFE20-MFG]

### Nets
5V: *#3.9 C50.1 C58.2 R36.2
GND: *#3.10 *#4.1(BOOT0) *#4.16(PB1) *#5.1 C49.2 C50.2 C51.2 C52.2 C53.1 C54.1 C55.1 C56.1 C57.1 C58.1 C59.1 C60.1 D8.2(C) LASER_CON.1 R34.1
PWRIMU: *#4.17(VSS)
3.3: R28.1 R31.1
A26: *#3.6
A27: *#3.5
C6: R21.1
C7: R28.2
C9: *#4.21(PA10)  [also labelled TP]
C11: R31.2
C13: R22.1
C14: R23.1
C16: R27.1
CON RX: R29.2
CON TX: R30.2
CSSUPPLY: C51.1 C52.1
D8: R?#2.1
D9: R?#1.1
D11: LASER_CON.6
D13: R33.2
D14: R32.2
D15: R24.1
D16: R25.1
D25: *#3.1
NC: LASER_CON.3
TP C: *#4.22(PA13)
TP?: *#4.18(VDD)
V: LASER_CON.2
Net*#3_2: *#3.2 R21.2
Net*#3_3: *#3.3 R22.2
Net*#3_4: *#3.4 R23.2
Net*#3_7: *#3.7 R24.2
Net*#3_8: *#3.8 R25.2
Net*#4_2: *#4.2(PF0/OSC_IN) C59.2 Y1.1
Net*#4_3: *#4.3(PF1/OSC_OUT) C60.2 Y1.2
Net*#4_5: *#4.5(VDDA) C54.2 L6.1
Net*#4_7: *#4.7(PA1) R35.2
Net*#4_8: *#4.8(VSS/VSSA) R33.1
Net*#4_9: *#4.9(PA2) R32.1
Net*#4_14: *#4.14(PA7) R26.1
Net*#4_19: *#4.19(PA8) R30.1
Net*#4_20: *#4.20(PA9) R29.1
Net*#5_2: *#5.2 C53.2
NetC55_2: C55.2 C56.2 C57.2 L6.2
NetD8_1: D8.1(A) R35.1
NetLASER_CON_4: LASER_CON.4 R?#1.2
NetLASER_CON_5: LASER_CON.5 R?#2.2

Not connected (* = marked no-connect by the designer): *#4 4(NRST)* 6(PA0)* 10(PA3) 11(PA4) 12(PA5) 13(PA6) 15(PB0) 23(PA14)* 24(PA15)* 25(PB3)* 26(PB4)* 27(PB5)* 28(PB6)*; C49 1; R26 2; R27 2; R34 2; R36 1

### Notes on the sheet
- (near LASER_CON) Text
- 1428P
- EEPROM
- DOOHAP
- OB2C

### Library data of the parts
*#5 = 2P
C49-C60 = CMP-2008-02962-1
D8 = CMP-35283-000001-2: LED GREEN CLEAR 0402 SMD; Lens Size: 1mm; Luminous Intensity: 28.5mcd; Viewing Angle: 130°; Forward Voltage: 1.9V; Test Current: 20mA; Lens Color: Colorless; Lens Style: Flat; Dominant Wavelength: 572nm; Case Code (Metric): 1005; Mount: Surface Mount; Case Code (Imperial): 0402; Length: 1mm; Width: 0.5mm; Case/Package: 0402; Lens Transparency: Clear; Height: 0.71mm; Packaging: Tape and Reel; Color: Green
L6 = CMP-06042-002477-1
R21-R36 R?#1 R?#2 = CMP-2002-07161-1
  R21-R25 R29 R30 R32 R33 R?#1 R?#2: VALUE: 100
  R26 R27: VALUE: 22
  R28 R31 R35: VALUE: 10K
  R34: VALUE: 8.5K
  R36: VALUE: 237K
Y1 = CMP-06858-000002-1

## Nets that join several sheets
5V: CSI (C39.2 L5.2 R12.2), 32P MCU (*#3.9 C50.1 C58.2 R36.2)
A13: power (14 pins), RXTRA (5 pins)
GND: CSI (19 pins), THERMAL (10 pins), power (38 pins), RXTRA (14 pins), 32P MCU (19 pins)
A10: THERMAL (J2.16 J2.18), power (22 pins)
A23: THERMAL (J2.31), RXTRA (C44.2 R19.1 R20.2)
A25: THERMAL (J2.29), power (R4.2), RXTRA (R18.1)
C9: THERMAL (J2.28), 32P MCU (*#4.21)
D25: THERMAL (J2.20), 32P MCU (*#3.1)
D27: THERMAL (J2.34), RXTRA (R16.1 R17.2)